# Altium schematic sheet USBCONN_3_A.SchDoc
size A3; SheetNumber: 16; SheetTotal: 22
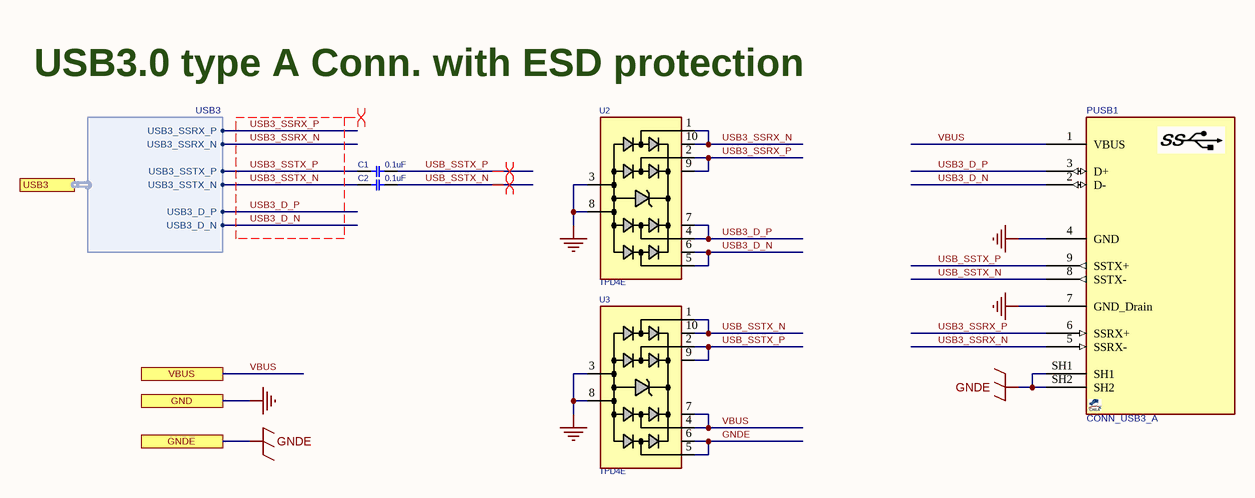
[diagram p0: USBCONN_3_A.SchDoc]

## Parts
C1  0.1uF  [C0201]
C2  0.1uF  [C0201]
PUSB1  CONN_USB3_A  [USB3_A_RA]
U2  TPD4E  [SON50_10_2510]
U3  TPD4E  [SON50_10_2510]

## Ports
GND, GNDE, USB3 (harness USB3), VBUS

## Harnesses
USB3: USB3_SSRX_P, USB3_SSRX_N, USB3_SSTX_P, USB3_SSTX_N, USB3_D_P, USB3_D_N

## Nets
GND: PUSB1.4(GND) PUSB1.7(GND_Drain) U2.3 U2.8 U3.3 U3.8 ; port GND
GNDE: PUSB1.SH1 PUSB1.SH2 U3.5 U3.6 ; port GNDE
USB3_D_N: PUSB1.2(D-) U2.5 U2.6 ; port USB3.USB3_D_N
USB3_D_P: PUSB1.3(D+) U2.4 U2.7 ; port USB3.USB3_D_P
USB3_SSRX_N: PUSB1.5(SSRX-) U2.1 U2.10 ; port USB3.USB3_SSRX_N
USB3_SSRX_P: PUSB1.6(SSRX+) U2.2 U2.9 ; port USB3.USB3_SSRX_P
USB3_SSTX_N: C2.1 ; port USB3.USB3_SSTX_N
USB3_SSTX_P: C1.1 ; port USB3.USB3_SSTX_P
USB_SSTX_N: C2.2 PUSB1.8(SSTX-) U3.1 U3.10
USB_SSTX_P: C1.2 PUSB1.9(SSTX+) U3.2 U3.9
VBUS: PUSB1.1(VBUS) U3.4 U3.7 ; port VBUS

## Layout directives
differential pair: USB3_D_N, USB3_D_P, USB3_SSRX_N, USB3_SSRX_P, USB3_SSTX_N, USB3_SSTX_P, USB_SSTX_N, USB_SSTX_P

## Notes on the sheet
- (near U2) USB3.0 type A Conn. with ESD protection

## Library data of the parts
C1 C2 = CAP_SMD_MLCC: CAP, MLCC; PARAM: X5R, 10%; MANF_P#: GRM155R61E104; MANF: Murata; PARAM2: 25v; PRICE: 10,000:	$0.006; ASSEMBLY: ASSEMBLY; VALUE: 0.1uF
PUSB1 = CONN_USB3_A_USB1075: CONN, USB3, A type, R/A, THD; MANF: GCT; PARAM2: 5,000 cycles; PARAM: 1.8A, -55~+85°C; MANF_P#: USB1075; VALUE: CONN_USB3_A
U2 U3 = TVS_X4_TPD4E05U06: TVS, ESD PROTECT, 4CH,; MANF_P#: TPD4E05U06DQA; MANF: Texas Instruments; PARAM2: 6.5Vbr, 0.4pF, –40°~125°C; PARAM: ±12-kV ContactD, ±15-kVAirD; PRICE: 0.6$; VALUE: TPD4E